# EAGLE design untitled (EAGLE 6.4)
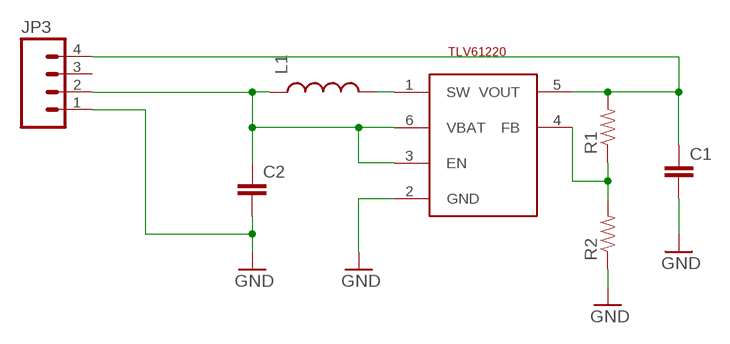
[diagram p0: schematic, sheet 1]

## Parts
C1  CAP0805  [0805]
C2  CAP0805  [0805]
JP3  M04LOCK  [1X04_LOCK]
L1  INDUCTOR0805  [0805]
R1  RESISTOR0805-RES  [0805]
R2  RESISTOR0805-RES  [0805]
U$1  TLV61220  TI-TLV61220  [SOT23-6L]

## Nets
GND: C1.2 C2.2 JP3.1 R2.1 U$1.2(GND)
N$1: C1.1 JP3.4 R1.2 U$1.5(VOUT)
N$13: L1.2 U$1.1(SW)
N$14: R1.1 R2.2 U$1.4(FB)
VIN: C2.1 JP3.2 L1.1 U$1.3(EN) U$1.6(VBAT)
Unconnected: JP3.3

## Library data of the parts
C1 C2 = SparkFun-Passives:CAP: Capacitor Standard 0603 ceramic capacitor, and 0.1" leaded capacitor.
JP3 = SparkFun-Connectors:M04: Header 4 Standard 4-pin 0.1" header. Use with straight break away headers (SKU : PRT-00116), right angle break away headers (PRT-00553), swiss pins (PRT-00743), machine pins (PRT-00117), and female headers (PRT-00115). Molex polarized connector foot print use with SKU : PRT-08231 with associated crimp pins and housings. 1MM SMD Version SKU: PRT-10208
L1 = SparkFun-Passives:INDUCTOR: Inductors Basic Inductor/Choke - 0603 and 1206. Footprints are not proven and vary greatly between part numbers.
R1 R2 = SparkFun-Passives:RESISTOR: Resistor Basic schematic elements and footprints for 0603, 1206, and PTH resistors.
U$1 = custom:TI-TLV61220

## Board
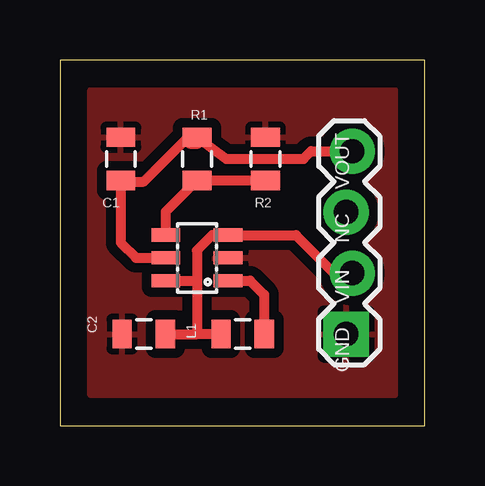
[diagram p1: board, top side]

Size 15.23 x 15.23 mm. Coordinates in mm from the lower left corner, seen from the top.
Outline: 0,0 15.23,0 15.23,15.23 0,15.23 0,0
Copper layers (1*2*15*16): Top 0.035mm / dielectric 0.2mm / layer 2 0.0175mm / dielectric 1.1mm / layer 15 0.0175mm / dielectric 0.2mm / Bottom 0.035mm
Design rules "SeeedStudio_DRU_no_angle_20130527": minimum track width 6mil, minimum drill 12mil, track to track 6mil, track to pad 6mil, pad to pad 6mil, via to via 6mil, smd to smd 0mil, copper to edge 10mil, drill to drill 10mil, minimum pad ring 6mil, minimum via ring 6mil, stop-mask expansion 2mil, vias tented up to drill 25mil, thermal gap 10mil

### Footprints (pad centres in the part's own frame; a part is rotated, then mirrored left to right if it is on the bottom)
0805 = smd 0.8 x 1.2: 1 -0.9,0; 2 0.9,0
1X04_LOCK = drill 1.016 pad 1.88 square: 1 0,0.127 | drill 1.016 pad 1.88: 2 2.54,-0.127; 3 5.08,0.127; 4 7.62,-0.127
SOT23-6L = smd 0.55 x 1.2: 1 -0.95,-1.3; 2 0,-1.3; 3 0.95,-1.3; 4 0.95,1.3; 5 0,1.3; 6 -0.95,1.3

### Placement (x,y rotation side)
C1  2.54,11.11 90 top
C2  3.49,3.81 180 top
JP3  12.06,3.81 90 top
L1  7.62,3.81 0 top
R1  5.71,11.11 90 top
R2  8.57,11.11 270 top
U$1  5.71,6.99 90 top

### Tracks (layer width: path | path; a pad name or v marks a point on that pad's centre or on a via)
GND
  pour Top (isolate 0.406): 1.27,13.97 13.97,13.97 13.97,1.27 1.27,1.27
N$1
  Top 0.406: U$1.5 3.17,6.99 2.54,7.62 C1.1 2.59,10.16 3.49,10.16 5.34,12.01 R1.2 | 5.4,11.75 5.77,11.75 R1.2 | R1.2 6.93,11.11 10.16,11.11 10.48,11.43 JP3.4
N$13
  Top 0.406: U$1.1 7.93,6.04 8.52,5.45 L1.2
N$14
  Top 0.406: R2.2 R1.1 4.42,8.91 U$1.4
VIN
  Top 0.406: 5.71,6.04 5.71,7.3 6.35,7.94 arc0 U$1.3 9.85,7.93 11.43,6.35 JP3.2 | 5.71,6.04 5.71,3.81 | U$1.6 5.71,6.04 | C2.1 5.71,3.81 | L1.1 5.71,3.81

### Text on the board
tPlace: VOUT | NC | VIN | GND